# Altium schematic sheet 5V_Supply.SchDoc
size A
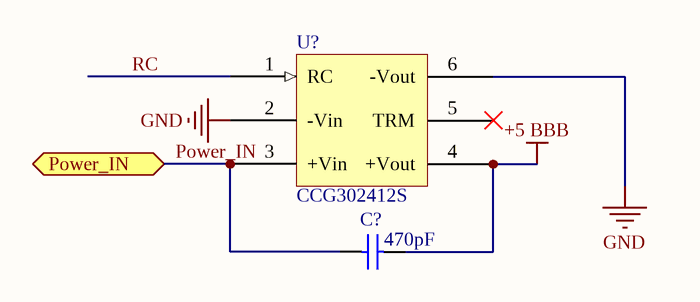
[diagram p0: 5V_Supply.SchDoc]

## Parts
C?  Capacitance: 470pF  [CAPC1812(4532)230_M]  (hidden comment: CAP CER 470PF 3KV X7R 1812)
U?  CCG302412S  [CCG30]

## Ports
Power_IN

## Nets
+5 BBB: C?.2 U?.4(+Vout)
GND: U?.2(-Vin) U?.6(-Vout)
Power_IN: C?.1 U?.3(+Vin) ; port Power_IN
RC: U?.1(RC)

Not connected (* = marked no-connect by the designer): U? 5(TRM)*

## Library data of the parts
C? = CMP-1040-00561-1: Manufacturer: Kemet; Manufacturer Part Number: C1812C471KHRACTU; Tolerance: 10%; Supplier 1: Digi-Key; Supplier Part Number 1: 399-7289-6-ND; Stock 1: 2705; Pricing 1: 1=0.88, 10=0.666, 100=0.4761 (USD); Case/Package: 1812; Case Code (Metric): 4532; Case Code (Imperial): 1812; Min Operating Temperature: -55°C; Max Operating Temperature: 125°C; Voltage Rating: 3kV; Packaging: Tape and Reel; Package Quantity: 1; Voltage Rating (DC): 3kV; Length: 0.177inch; Width: 0.126inch; Thickness: 0.071inch; Lead Free: Lead Free; ComponentLink1URL: http://www.kemet.com/docfinder?Partnumber=C1812C471KHRACTU; ComponentLink1Description: http://www.kemet.com/docfinder?Partnumber=C1812C471KHRACTU
U? = CCG302412S: DC/DC CONVERTER 12V 2.5A PCB; Power (Watts) - Manufacture Series: 30W; Manufacturer 1: TDK-Lambda Americas Inc; Number of Outputs: 1; Voltage - Input (Min): 9V; Voltage - Input (Max): 36V; Voltage - Isolation: 1.5kV (1500V); Efficiency: 89%; Category 1: Power Supplies - Board Mount; Packaging: Tube; Type: Isolated Module; Voltage - Output 1: 12V; Voltage - Output 2: -; Voltage - Output 3: -; Current - Output (Max): 2.5A; Features: Remote On/Off, OCP; Mounting Type: Through Hole; Package / Case: 6-DIP Module (6 Leads); Size / Dimension: 1.00" L x 1.00" W x 0.39" H (25.4mm x 25.4mm x 9.9mm); Operating Temperature: -40°C ~ 85°C; Power (Watts) - Max: 30W; ComponentLink1URL: http://www.us.tdk-lambda.com/ftp/specs/ccg30.pdf; ComponentLink1Description: http://www.us.tdk-lambda.com/ftp/specs/ccg30.pdf; Supplier 1: Digi-Key; Supplier Part Number 1: 285-2419-ND; Manufacturer Part Number 1: CCG302412S; RoHS 1: RoHS Compliant; Description 1: DC/DC CONVERTER 12V 2.5A PCB; Stock 1: 30; Pricing 1: 1=43.63, 10=42.95 (USD)